# Altium schematic sheet Sheet1.SchDoc
size A2; SheetNumber: 1; SheetTotal: 1
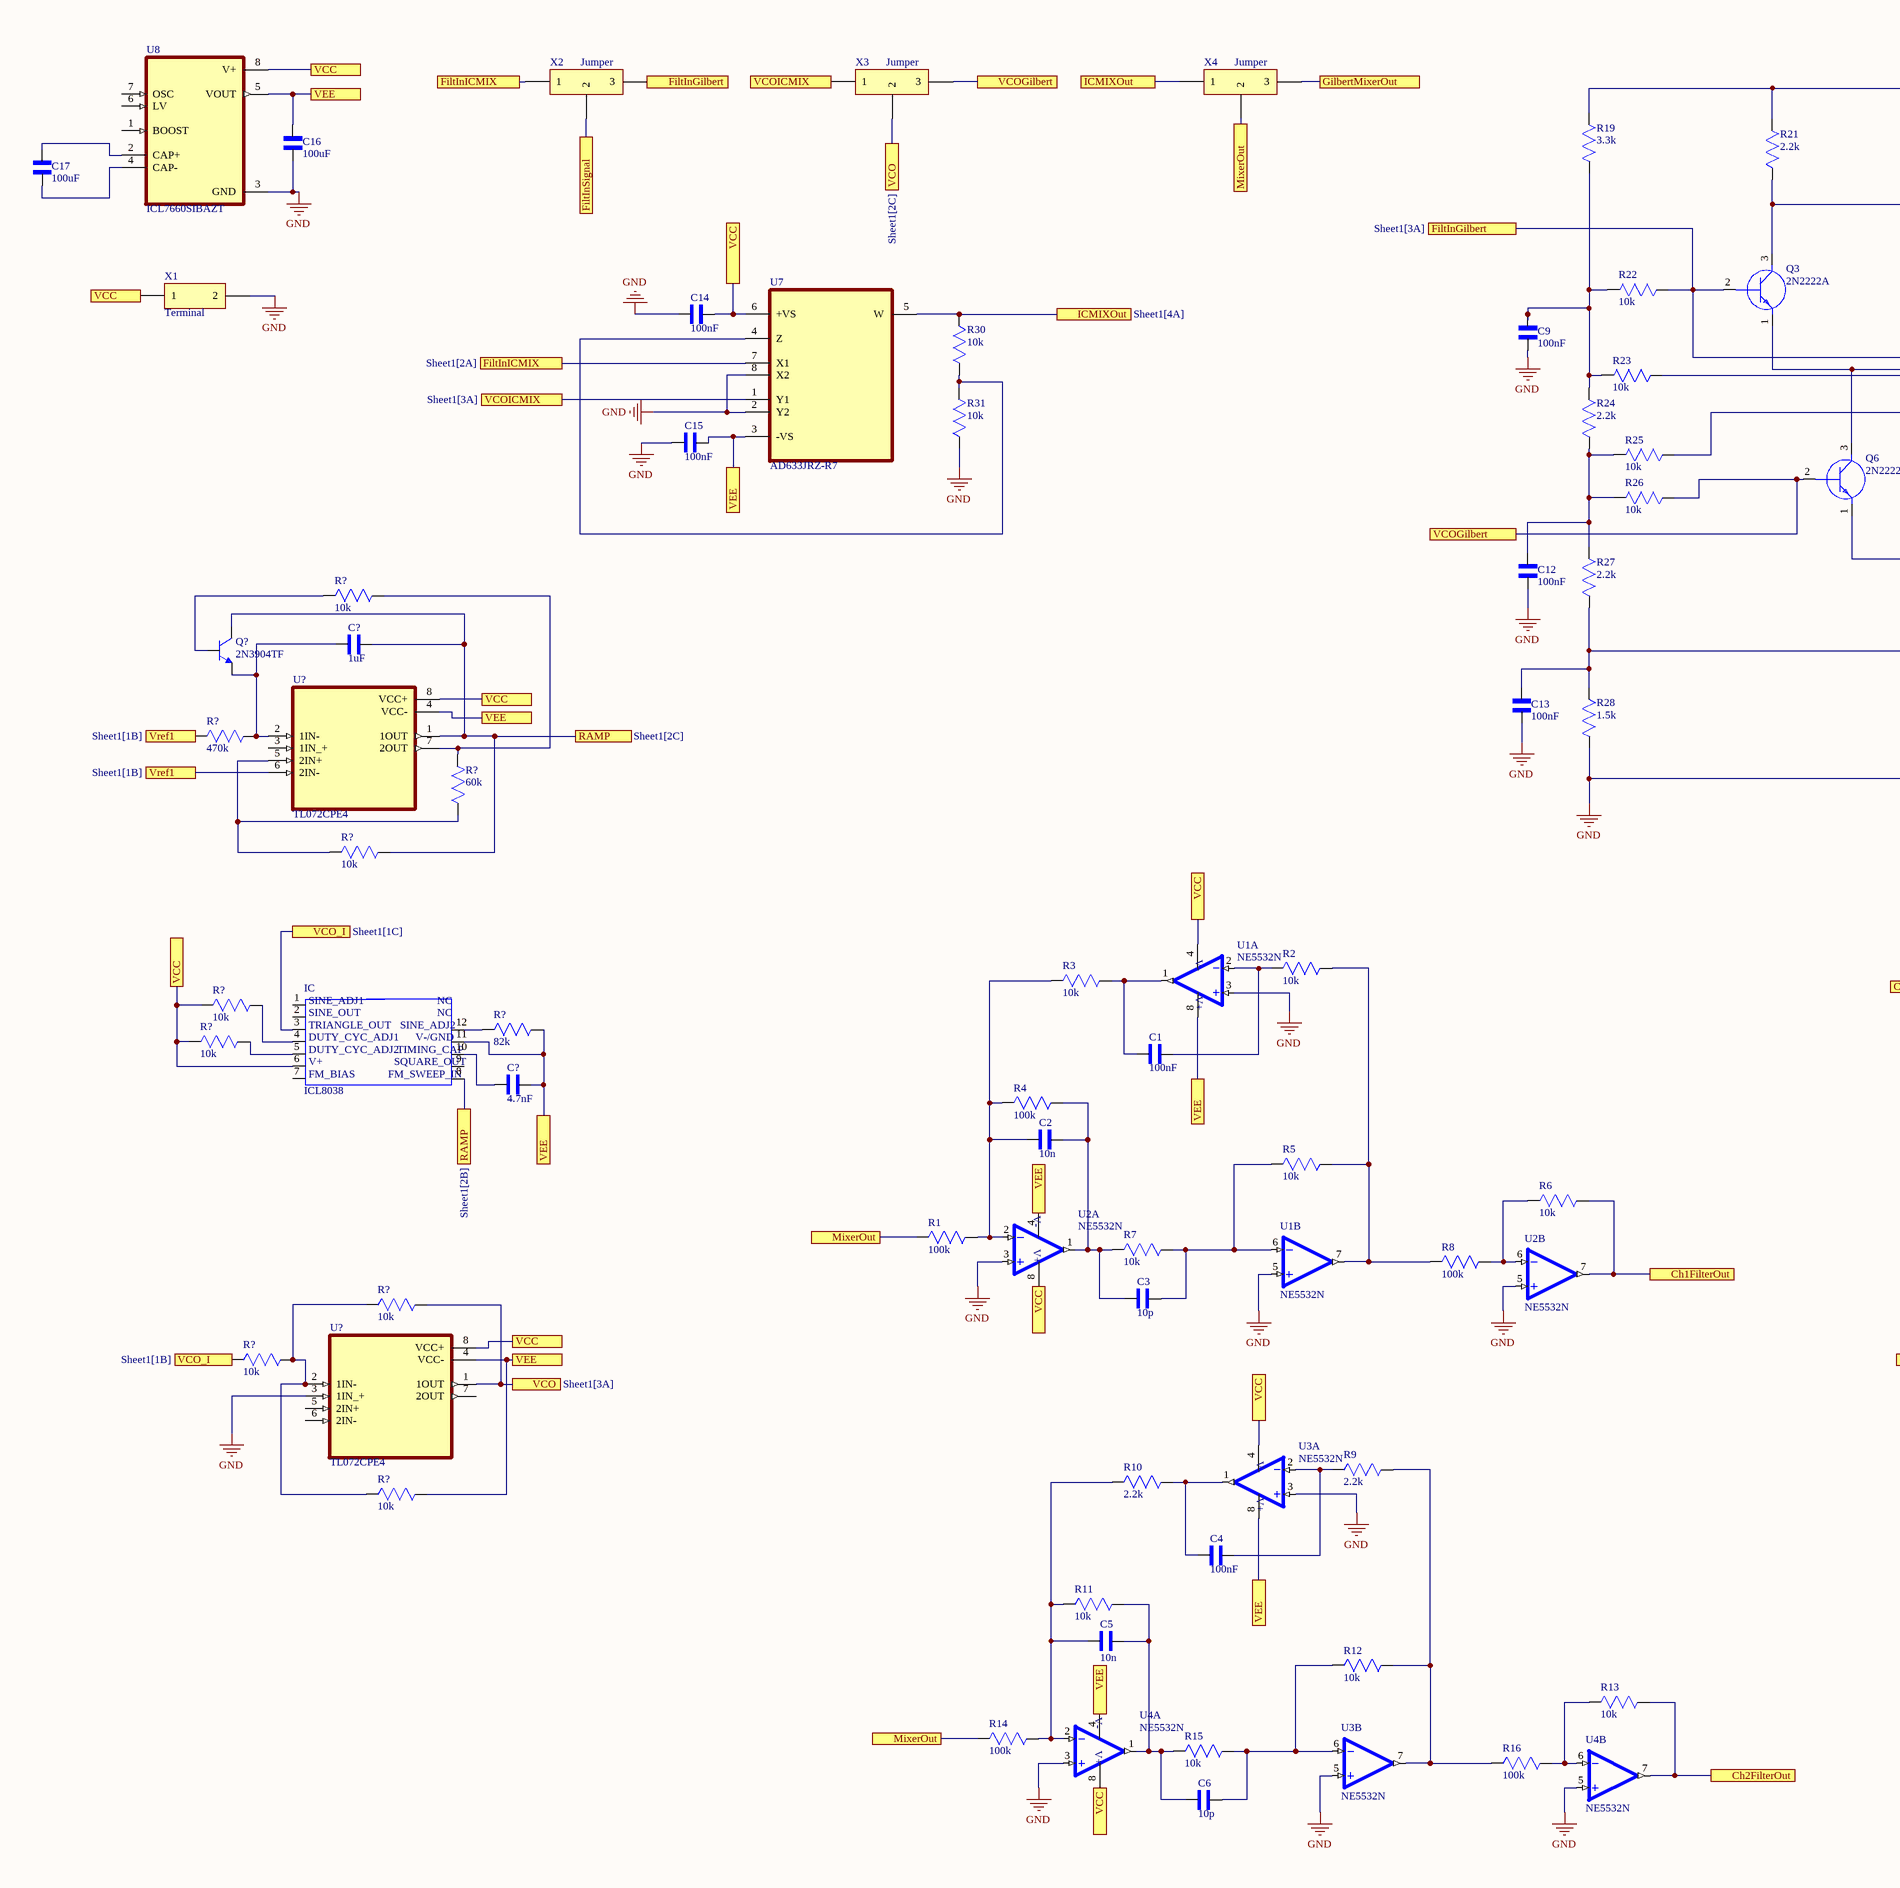
[diagram p0: Sheet1.SchDoc, left]
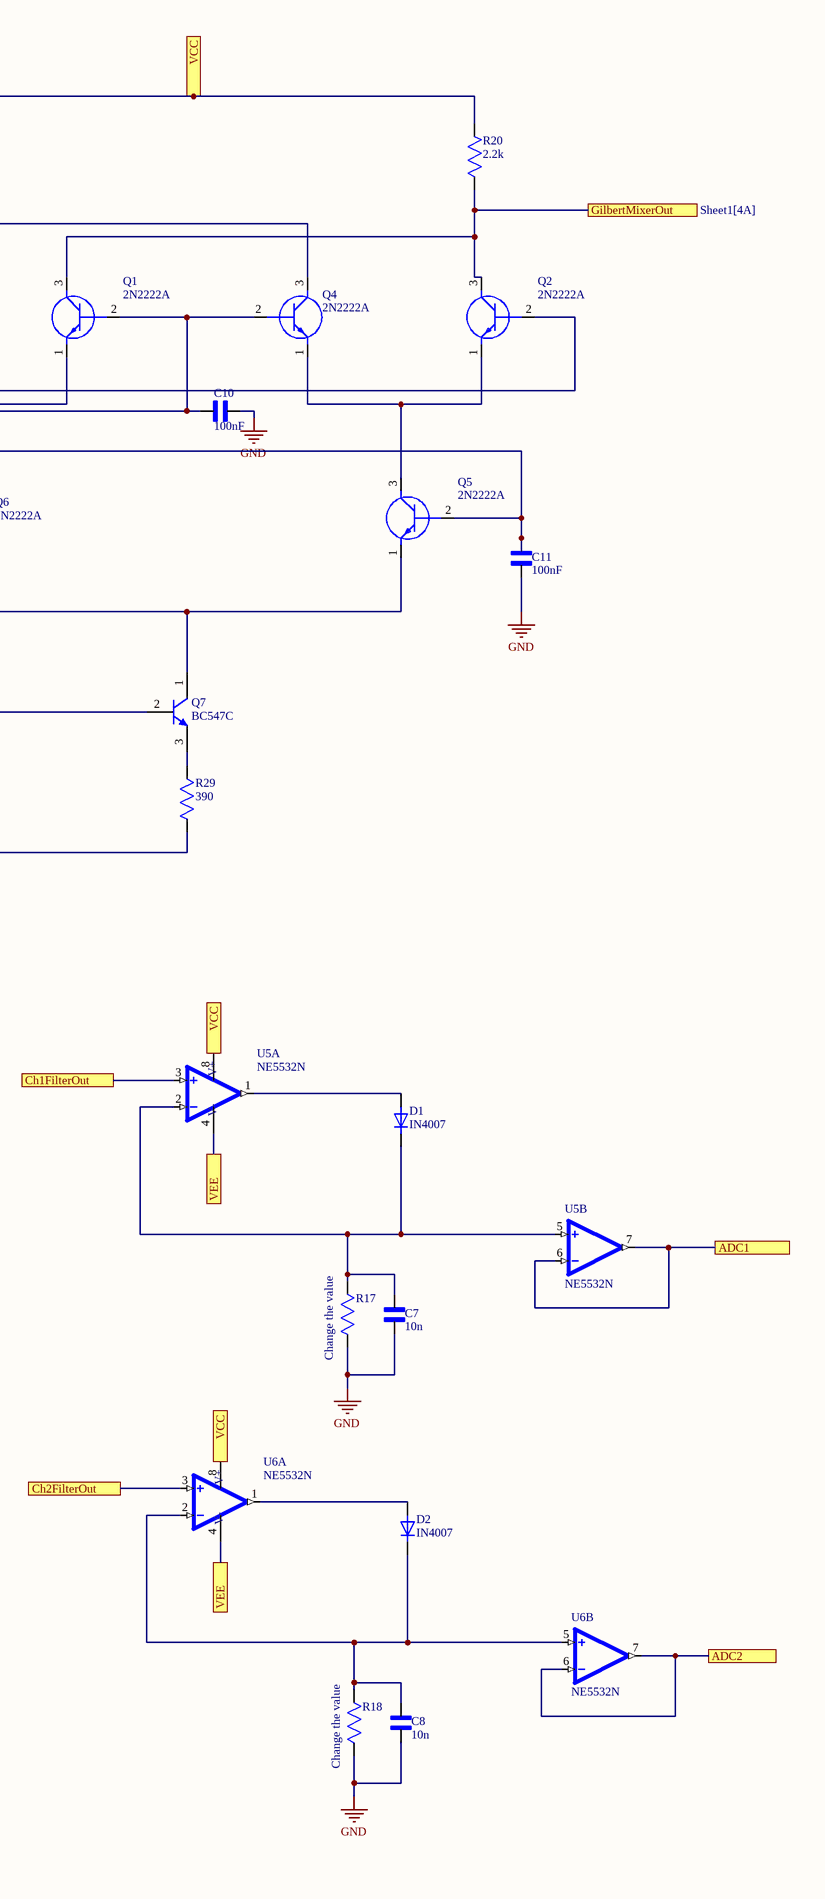
[diagram p1: Sheet1.SchDoc, right]

## Parts
(Parts that share a designator on the sheet are numbered #1, #2 ... from top to bottom, then left to right.)
C1  100nF  [CAPC2012X95N]
C2  10n  [CAPC2012X95N]
C3  10p  [CAPC2012X95N]
C4  100nF  [CAPC2012X95N]
C5  10n  [CAPC2012X95N]
C6  10p  [CAPC2012X95N]
C7  10n  [CAPC2012X95N]
C8  10n  [CAPC2012X95N]
C9  100nF  [CAPC2012X95N]
C10  100nF  [CAPC2012X95N]
C11  100nF  [CAPC2012X95N]
C12  100nF  [CAPC2012X95N]
C13  100nF  [CAPC2012X95N]
C14  100nF  [CAPC2012X95N]
C15  100nF  [CAPC2012X95N]
C16  100uF  [CAPC2012X95N]
C17  100uF  [CAPC2012X95N]
C?#1  1uF  [CAPC2012X95N]
C?#2  4.7nF  [CAPC2012X95N]
D1  IN4007  [DIOAD1070W78L470D235P]
D2  IN4007  [DIOAD1070W78L470D235P]
IC  ICL8038  [ICL8038]
Q1  2N2222A  [2N2222A]
Q2  2N2222A  [2N2222A]
Q3  2N2222A  [2N2222A]
Q4  2N2222A  [2N2222A]
Q5  2N2222A  [2N2222A]
Q6  2N2222A  [2N2222A]
Q7  BC547C  [ONSC-TO-92-3-29-11]
Q?  2N3904TF  [TO92254P520H877-3]
R1  100k  [RC0805N_YAG-M]
R2  10k  [RC0805N_YAG-M]
R3  10k  [RC0805N_YAG-M]
R4  100k  [RC0805N_YAG-M]
R5  10k  [RC0805N_YAG-M]
R6  10k  [RC0805N_YAG-M]
R7  10k  [RC0805N_YAG-M]
R8  100k  [RC0805N_YAG-M]
R9  2.2k  [RC0805N_YAG-M]
R10  2.2k  [RC0805N_YAG-M]
R11  10k  [RC0805N_YAG-M]
R12  10k  [RC0805N_YAG-M]
R13  10k  [RC0805N_YAG-M]
R14  100k  [RC0805N_YAG-M]
R15  10k  [RC0805N_YAG-M]
R16  100k  [RC0805N_YAG-M]
R17  Change the value  [RC0805N_YAG-M]
R18  Change the value  [RC0805N_YAG-M]
R19  3.3k  [RC0805N_YAG-M]
R20  2.2k  [RC0805N_YAG-M]
R21  2.2k  [RC0805N_YAG-M]
R22  10k  [RC0805N_YAG-M]
R23  10k  [RC0805N_YAG-M]
R24  2.2k  [RC0805N_YAG-M]
R25  10k  [RC0805N_YAG-M]
R26  10k  [RC0805N_YAG-M]
R27  2.2k  [RC0805N_YAG-M]
R28  1.5k  [RC0805N_YAG-M]
R29  390  [RC0805N_YAG-M]
R30  10k  [RC0805N_YAG-M]
R31  10k  [RC0805N_YAG-M]
R?#1  10k  [RC0805N_YAG-M]
R?#2  470k  [RC0805N_YAG-M]
R?#3  60k  [RC0805N_YAG-M]
R?#4  10k  [RC0805N_YAG-M]
R?#5  10k  [RC0805N_YAG-M]
R?#6  82k  [RC0805N_YAG-M]
R?#7  10k  [RC0805N_YAG-M]
R?#8  10k  [RC0805N_YAG-M]
R?#9  10k  [RC0805N_YAG-M]
R?#10  10k  [RC0805N_YAG-M]
U1  NE5532N  [DIP766W45P254L1016H533Q8]  (parts A,B of 2)
U2  NE5532N  [DIP766W45P254L1016H533Q8]  (parts A,B of 2)
U3  NE5532N  [DIP766W45P254L1016H533Q8]  (parts A,B of 2)
U4  NE5532N  [DIP766W45P254L1016H533Q8]  (parts A,B of 2)
U5  NE5532N  [DIP766W45P254L1016H533Q8]  (parts A,B of 2)
U6  NE5532N  [DIP766W45P254L1016H533Q8]  (parts A,B of 2)
U7  AD633JRZ-R7  [SOIC127P600X175-8N]
U8  ICL7660SIBAZT  [SOIC127P600X175-8N]
U?#1  TL072CPE4  [DIP794W45P254L959H508Q8]
U?#2  TL072CPE4  [DIP794W45P254L959H508Q8]
X1  Terminal  [CON_TERMINAL_2POL]
X2  Jumper  [CON_TERMINAL_3POL]
X3  Jumper  [CON_TERMINAL_3POL]
X4  Jumper  [CON_TERMINAL_3POL]

## Ports
ADC1, ADC2, Ch1FilterOut (see Sheet1[5C]), Ch1FilterOut (see Sheet1[6C]), Ch2FilterOut (see Sheet1[6C]), Ch2FilterOut (see Sheet1[6D]), FiltInGilbert (see Sheet1[3A]), FiltInGilbert (see Sheet1[5A]), FiltInICMIX (see Sheet1[2A]), FiltInSignal, GilbertMixerOut (see Sheet1[4A]), GilbertMixerOut (see Sheet1[8A]), ICMIXOut (see Sheet1[4A]), MixerOut (see Sheet1[3C], Sheet1[3D]), MixerOut (see Sheet1[3C], Sheet1[4A]), MixerOut (see Sheet1[3D], Sheet1[4A]), RAMP (see Sheet1[2B]), RAMP (see Sheet1[2C]), VCC (see Sheet1[1A], Sheet1[1C], Sheet1[2A], Sheet1[2B], Sheet1[2C], Sheet1[3A], Sheet1[4B], Sheet1[4C], Sheet1[4D], Sheet1[7A], Sheet1[7C]), VCC (see Sheet1[1A], Sheet1[1C], Sheet1[2A], Sheet1[2B], Sheet1[2C], Sheet1[3A], Sheet1[4B], Sheet1[4C], Sheet1[4D], Sheet1[7C]), VCC (see Sheet1[1A], Sheet1[1C], Sheet1[2A], Sheet1[2B], Sheet1[2C], Sheet1[3A], Sheet1[4B], Sheet1[4C], Sheet1[7A], Sheet1[7C]), VCC (see Sheet1[1A], Sheet1[1C], Sheet1[2A], Sheet1[2B], Sheet1[2C], Sheet1[3A], Sheet1[4C], Sheet1[4D], Sheet1[7A], Sheet1[7C]), VCC (see Sheet1[1A], Sheet1[1C], Sheet1[2A], Sheet1[2B], Sheet1[2C], Sheet1[4B], Sheet1[4C], Sheet1[4D], Sheet1[7A], Sheet1[7C]), VCC (see Sheet1[1A], Sheet1[1C], Sheet1[2A], Sheet1[2B], Sheet1[3A], Sheet1[4B], Sheet1[4C], Sheet1[4D], Sheet1[7A], Sheet1[7C]), VCC (see Sheet1[1A], Sheet1[1C], Sheet1[2A], Sheet1[2C], Sheet1[3A], Sheet1[4B], Sheet1[4C], Sheet1[4D], Sheet1[7A], Sheet1[7C]), VCC (see Sheet1[1A], Sheet1[1C], Sheet1[2B], Sheet1[2C], Sheet1[3A], Sheet1[4B], Sheet1[4C], Sheet1[4D], Sheet1[7A], Sheet1[7C]), VCC (see Sheet1[1A], Sheet1[2A], Sheet1[2B], Sheet1[2C], Sheet1[3A], Sheet1[4B], Sheet1[4C], Sheet1[4D], Sheet1[7A], Sheet1[7C]), VCC (see Sheet1[1C], Sheet1[2A], Sheet1[2B], Sheet1[2C], Sheet1[3A], Sheet1[4B], Sheet1[4C], Sheet1[4D], Sheet1[7A], Sheet1[7C]), VCO (see Sheet1[2C]), VCO (see Sheet1[3A]), VCO_I (see Sheet1[1B]), VCO_I (see Sheet1[1C]), VCOGilbert (see Sheet1[3A]), VCOGilbert (see Sheet1[5B]), VCOICMIX (see Sheet1[2A]), VCOICMIX (see Sheet1[3A]), VEE (see Sheet1[2A], Sheet1[2B], Sheet1[2C], Sheet1[3B], Sheet1[4C], Sheet1[4D], Sheet1[7C]), VEE (see Sheet1[2A], Sheet1[2B], Sheet1[2C], Sheet1[3B], Sheet1[4C], Sheet1[4D], Sheet1[7C], Sheet1[7D]), VEE (see Sheet1[2A], Sheet1[2B], Sheet1[2C], Sheet1[3B], Sheet1[4C], Sheet1[4D], Sheet1[7D]), VEE (see Sheet1[2A], Sheet1[2B], Sheet1[2C], Sheet1[4C], Sheet1[4D], Sheet1[7C], Sheet1[7D]), VEE (see Sheet1[2A], Sheet1[2C], Sheet1[3B], Sheet1[4C], Sheet1[4D], Sheet1[7C], Sheet1[7D]), VEE (see Sheet1[2B], Sheet1[2C], Sheet1[3B], Sheet1[4C], Sheet1[4D], Sheet1[7C], Sheet1[7D]), Vref1 (see Sheet1[1B])

## Nets
GND: C7.2 C8.2 C9.2 C10.1 C11.1 C12.2 C13.2 C14.1 C15.1 C16.2 R17.1 R18.1 R28.1 R29.1 R31.2 U1.3(+INA) U1.5(+INB) U2.3(+INA) U2.5(+INB) U3.3(+INA) U3.5(+INB) U4.3(+INA) U4.5(+INB) U7.2(Y2) U7.8(X2) U8.3(GND) U?#2.3(1IN_+) X1.2
ADC1: U5.6(-INB) U5.7(OUTB) ; port ADC1
ADC2: U6.6(-INB) U6.7(OUTB) ; port ADC2
Ch1FilterOut: R6.1 U2.7(OUTB) U5.3(+INA) ; port Ch1FilterOut
Ch2FilterOut: R13.1 U4.7(OUTB) U6.3(+INA) ; port Ch2FilterOut
FiltInGilbert: Q2.2(B) Q3.2(B) R22.2 X2.3 ; port FiltInGilbert
FiltInICMIX: U7.7(X1) X2.1 ; port FiltInICMIX
FiltInSignal: X2.2 ; port FiltInSignal
GilbertMixerOut: Q1.3(C) Q2.3(C) R20.1 X4.3 ; port GilbertMixerOut
ICMIXOut: R30.1 U7.5(W) X4.1 ; port ICMIXOut
MixerOut: R1.2 R14.2 X4.2 ; port MixerOut
RAMP: C?#1.2 IC.8 Q?.3(C) R?#4.1 U?#1.1(1OUT) ; port RAMP
VCC: C14.2 IC.6 R19.2 R20.2 R21.2 R?#5.2 R?#7.2 U1.4(V-) U2.8(V+) U3.4(V-) U4.8(V+) U5.8(V+) U6.8(V+) U7.6(+VS) U8.8(V+) U?#1.8(VCC+) U?#2.8(VCC+) X1.1 ; port VCC
VCO: R?#8.1 U?#2.1(1OUT) X3.2 ; port VCO
VCO_I: IC.3 R?#9.2 ; port VCO_I
VCOGilbert: Q6.2(B) R26.2 X3.3 ; port VCOGilbert
VCOICMIX: U7.1(Y1) X3.1 ; port VCOICMIX
VEE: C15.2 C16.1 C?#2.2 IC.11 R?#6.1 R?#10.1 U1.8(V+) U2.4(V-) U3.8(V+) U4.4(V-) U5.4(V-) U6.4(V-) U7.3(-VS) U8.5(VOUT) U?#1.4(VCC-) U?#2.4(VCC-) ; port VEE
Vref1: R?#2.2 U?#1.6(2IN-) ; port Vref1
NetC1_1: C1.1 R3.1 U1.1(OUTA)
NetC1_2: C1.2 R2.2 U1.2(-INA)
NetC2_1: C2.1 R1.1 R3.2 R4.2 U2.2(-INA)
NetC2_2: C2.2 C3.1 R4.1 R7.2 U2.1(OUTA)
NetC3_2: C3.2 R5.2 R7.1 U1.6(-INB)
NetC4_1: C4.1 R10.1 U3.1(OUTA)
NetC4_2: C4.2 R9.2 U3.2(-INA)
NetC5_1: C5.1 R10.2 R11.2 R14.1 U4.2(-INA)
NetC5_2: C5.2 C6.1 R11.1 R15.2 U4.1(OUTA)
NetC6_2: C6.2 R12.2 R15.1 U3.6(-INB)
NetC7_1: C7.1 D1.C R17.2 U5.2(-INA) U5.5(+INB)
NetC8_1: C8.1 D2.C R18.2 U6.2(-INA) U6.5(+INB)
NetC9_1: C9.1 R19.1 R22.1 R23.1 R24.2
NetC10_2: C10.2 Q1.2(B) Q4.2(B) R23.2
NetC11_2: C11.2 Q5.2(B) R25.2
NetC12_1: C12.1 R24.1 R25.1 R26.1 R27.2
NetC13_1: C13.1 Q7.2(B) R27.1 R28.2
NetC17_1: C17.1 U8.2(CAP+)
NetC17_2: C17.2 U8.4(CAP-)
NetC?#1_1: C?#1.1 Q?.1(E) R?#2.1 U?#1.2(1IN-)
NetC?#2_1: C?#2.1 IC.10
NetD1_A: D1.A U5.1(OUTA)
NetD2_A: D2.A U6.1(OUTA)
NetIC_4: IC.4 R?#5.1
NetIC_5: IC.5 R?#7.1
NetIC_12: IC.12 R?#6.2
NetQ1_1: Q1.1(E) Q3.1(E) Q6.3(C)
NetQ2_1: Q2.1(E) Q4.1(E) Q5.3(C)
NetQ3_3: Q3.3(C) Q4.3(C) R21.1
NetQ5_1: Q5.1(E) Q6.1(E) Q7.1(C)
NetQ7_3: Q7.3(E) R29.2
NetQ?_2: Q?.2(B) R?#1.2
NetR2_1: R2.1 R5.1 R8.2 U1.7(OUTB)
NetR6_2: R6.2 R8.1 U2.6(-INB)
NetR9_1: R9.1 R12.1 R16.2 U3.7(OUTB)
NetR13_2: R13.2 R16.1 U4.6(-INB)
NetR30_2: R30.2 R31.1 U7.4(Z)
NetR?#1_1: R?#1.1 R?#3.1 U?#1.7(2OUT)
NetR?#3_2: R?#3.2 R?#4.2 U?#1.5(2IN+)
NetR?#8_2: R?#8.2 R?#9.1 R?#10.2 U?#2.2(1IN-)

Not connected (* = marked no-connect by the designer): IC 1 2 7 9; U8 1(BOOST) 6(LV) 7(OSC); U?#1 3(1IN_+); U?#2 5(2IN+) 6(2IN-) 7(2OUT)

## Notes on the sheet
- (in symbol ICL8038) SINE_ADJ1; NC; SINE_OUT; TRIANGLE_OUT; SINE_ADJ2; DUTY_CYC_ADJ1; V-/GND; DUTY_CYC_ADJ2; TIMING_CAP; V+; SQUARE_OUT; FM_BIAS; FM_SWEEP_IN

## Library data of the parts
C1 C4 C9-C15 C?#1 C?#2 = CAP_0805_GENERIC: 0.1 ÂµF Â±10% 50V Ceramic Capacitor X7R 0805 (2012 Metric); MF: Samsung Electro-Mechanics; MP: CL21B104KBCNNNC; SnapEDA_Link: https://www.snapeda.com/parts/CL21B104KBCNNNC/Samsung/view-part/?ref=snap; Package: SMD-2 Samsung; Check_prices: https://www.snapeda.com/parts/CL21B104KBCNNNC/Samsung/view-part/?ref=eda; Voltage: 50V
  C1 C4 C9-C15: Value: 100nF
  C?#1: Value: 1uF
  C?#2: Value: 4.7nF
C2 C3 C5-C8 C16 C17 = CAP_0805_GENERIC: 0.1 ÂµF Â±10% 50V Ceramic Capacitor X7R 0805 (2012 Metric); Value: 100nF; MF: Samsung Electro-Mechanics; MP: CL21B104KBCNNNC; SnapEDA_Link: https://www.snapeda.com/parts/CL21B104KBCNNNC/Samsung/view-part/?ref=snap; Package: SMD-2 Samsung; Check_prices: https://www.snapeda.com/parts/CL21B104KBCNNNC/Samsung/view-part/?ref=eda; Voltage: 50V
D1 D2 = IN4007: Diode Standard 1000 V 1A Through Hole DO-204AL (DO-41); MF: Vishay Semiconductor; SnapEDA_Link: https://www.snapeda.com/parts/IN4007/Vishay/view-part/?ref=snap; Package: DO-41 Vishay Semiconductor; Value: *; MP: IN4007; Check_prices: https://www.snapeda.com/parts/IN4007/Vishay/view-part/?ref=eda
IC = ICL8038: IC OSCILL GEN/VOLT CONTROL 14DIP; MF: Renesas Electronics; Value: *; Price: None; MP: ICL8038; Availability: Unavailable; SnapEDA_Link: https://www.snapeda.com/parts/ICL8038/Renesas%20Electronics%20America%20Inc./view-part/1764984/?ref=snap; Package: None
Q1-Q6 = 2N2222A: Transistor BJT NPN; Manufacturer_Name: Diotec; Datasheet Link: https://diotec.com/request/datasheet/2n2222a.pdf; Height: 7.5mm; Manufacturer_Part_Number: 2N2222A; Mouser Part Number: 637-2N2222A; Mouser Price/Stock: https://www.mouser.co.uk/ProductDetail/Diotec-Semiconductor/2N2222A?qs=OlC7AqGiEDmNlRSTGL2dYg%3D%3D; Arrow Part Number: 2N2222A; Arrow Price/Stock: https://www.arrow.com/en/products/2n2222a/diotec-semiconductor-ag
Q7 = ONSC-NPN-C1B2E3-3: Amplifier Transistor, NPN Silicon, 3-Pin TO-92, Bulk Box; Manufacturer: On Semiconductor; IC Continuous (A): 0.1; fT Min (MHz): 150; Mounting Technology: Through Hole; ComponentLink1URL: http://www.onsemi.com/; ComponentLink1Description: Manufacturer URL; ComponentLink3URL: http://www.onsemi.cn/pub_link/Collateral/2N6426-D.PDF; DatasheetVersion: Rev. 7; PackageVersion: Rev. AM; Packing: Bulk Box; RoHS: FALSE; Polarity: NPN; PartNumber: BC547C; ComponentLink2URL: http://www.onsemi.com/pub_link/Collateral/BC546-D.PDF; ComponentLink3Description: Package Specification; PackageDescription: 3-Pin Transistor Outline, Body 4.825 x 3.685 mm, Pitch 1.27 mm; PackageReference: TO-92-3-29-11_AM_SL; ComponentLink2Description: Datasheet
Q? = 2N3904TF: Transistor General Purpose BJT NPN 40 Volt 0.2 Amp 3-Pin TO-92 Tape And Reel; MF: Fairchild Semiconductor; SnapEDA_Link: https://www.snapeda.com/parts/2N3904TF/Fairchild+Imaging/view-part/?ref=snap; Package: TO-92-3 ON Semiconductor; Value: *; MP: 2N3904TF; Check_prices: https://www.snapeda.com/parts/2N3904TF/Fairchild+Imaging/view-part/?ref=eda
R1 R4 R8-R10 R14 R16-R21 R24 R27-R29 = RES_0805_GENERIC_1: Description; Manufacturer_Name: Yageo; Manufacturer_Part_Number: RC0805FR-0710KL; Value: 10k; Copyright: Copyright (C) 2025 Ultra Librarian. All rights reserved.
R2 R3 R5-R7 R11-R13 R15 R22 R23 R25 R26 R30 R31 R?#1-R?#10 = RES_0805_GENERIC_1: Description; Manufacturer_Name: Yageo; Manufacturer_Part_Number: RC0805FR-0710KL; Copyright: Copyright (C) 2025 Ultra Librarian. All rights reserved.
  R2 R3 R5-R7 R11-R13 R15 R22 R23 R25 R26 R30 R31 R?#1 R?#4 R?#5 R?#7-R?#10: Value: 10k
  R?#2: Value: 470k
  R?#3: Value: 60k
  R?#6: Value: 82k
U1-U6 = NE5532N: IC, OP AMP, DUAL; No. of Amplifiers: 2 Amplifier; Bandwidth: 10MHz; Slew Rate: 8V/Âµs; Supply Voltage Range: Â± 15V; Amplifier Case Style: DIP; No. of Pins: 8Pins; Operating Temperature Min: 0Â°C; Operating Temperature Max: 70Â°C; MSL: -; SVHC: No SVHC (1; MF: Fairchild Semiconductor; SnapEDA_Link: https://www.snapeda.com/parts/NE5532N/Fairchild+Imaging/view-part/?ref=snap; Package: PDIP-8 ON Semiconductor; Value: *; MP: NE5532N; Check_prices: https://www.snapeda.com/parts/NE5532N/Fairchild+Imaging/view-part/?ref=eda
U7 = AD633JRZ-R7: Analog Multiplier 4-Quadrant 8-SOIC; MF: Analog Devices; MP: AD633AR; SnapEDA_Link: https://www.snapeda.com/parts/AD633AR/Analog+Devices/view-part/?ref=snap; Package: SOIC-8 Analog Devices; Value: *; Check_prices: https://www.snapeda.com/parts/AD633AR/Analog+Devices/view-part/?ref=eda
U8 = ICL7660SIBAZT: Charge Pump Switching Regulator IC Positive or Negative Fixed -Vin, 2Vin 1 Output 45mA 8-SOIC (0.154, 3.90mm Width); MF: Renesas Electronics America Inc; SnapEDA_Link: https://www.snapeda.com/parts/ICL7660SIBAZT/Renesas/view-part/?ref=snap; Package: SOIC-8 Renesas Electronics America Inc; Value: *; MP: ICL7660SIBAZT; Check_prices: https://www.snapeda.com/parts/ICL7660SIBAZT/Renesas/view-part/?ref=eda
U?#1 U?#2 = TL072CPE4: Dual Low-Noise JFET-Input General-Purpose Operational Amplifier 8-PDIP 0 to 70; MF: Texas Instruments; SnapEDA_Link: https://www.snapeda.com/parts/TL072CPE4/Texas+Instruments/view-part/?ref=snap; Package: PDIP-8 Texas; Value: *; MP: TL072CPE4; Check_prices: https://www.snapeda.com/parts/TL072CPE4/Texas+Instruments/view-part/?ref=eda
X1 = CON_TERMINAL_2POL: Terminal Screw; Manufacturer_Name: Yageo; Manufacturer_Part_Number: RC0805FR-0710KL; Value: 10k; Copyright: Copyright (C) 2025 Ultra Librarian. All rights reserved.
X2-X4 = CON_TERMINAL_3POL: Terminal block; Manufacturer_Name: Yageo; Manufacturer_Part_Number: RC0805FR-0710KL; Value: 10k; Copyright: Copyright (C) 2025 Ultra Librarian. All rights reserved.